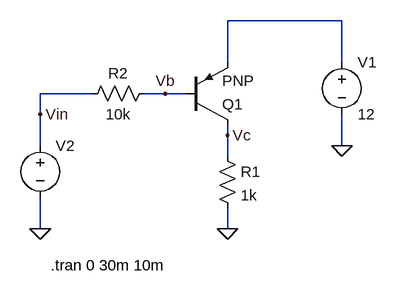
[diagram p0: schematic lab4_2_positive.asc]
lab4_2_positive.asc, the LTspice schematic file:
Version 4
SHEET 1 880 680
WIRE 544 -32 368 -32
WIRE 368 32 368 -32
WIRE 544 32 544 -32
WIRE 160 80 80 80
WIRE 272 80 240 80
WIRE 304 80 272 80
WIRE 80 112 80 80
WIRE 368 144 368 128
WIRE 80 160 80 112
WIRE 544 160 544 112
WIRE 368 176 368 144
WIRE 80 288 80 240
WIRE 368 288 368 256
FLAG 272 80 Vb
FLAG 368 144 Vc
FLAG 80 112 Vin
FLAG 368 288 0
FLAG 544 160 0
FLAG 80 288 0
SYMBOL voltage 80 144 R0
WINDOW 3 24 96 Invisible 2
WINDOW 123 0 0 Left 0
WINDOW 39 0 0 Left 0
SYMATTR Value PULSE(0 12 10e-3 10e-3 10e-3 10e-3 30e-3 1)
SYMATTR InstName V2
SYMBOL res 144 96 R270
WINDOW 0 32 56 VTop 2
WINDOW 3 0 56 VBottom 2
SYMATTR InstName R2
SYMATTR Value 10k
SYMBOL res 352 160 R0
SYMATTR InstName R1
SYMATTR Value 1k
SYMBOL voltage 544 16 R0
WINDOW 123 0 0 Left 0
WINDOW 39 0 0 Left 0
SYMATTR InstName V1
SYMATTR Value 12
SYMBOL pnp 304 128 M180
SYMATTR InstName Q1
TEXT 96 344 Left 2 !.tran 0 30m 10m

The netlist it stands for:
* lab4_2_positive.asc
V2 Vin 0 PULSE(0 12 10e-3 10e-3 10e-3 10e-3 30e-3 1)
R2 Vin Vb 10k
R1 Vc 0 1k
V1 N001 0 12
Q1 Vc Vb N001 0 PNP
.model NPN NPN
.model PNP PNP
.lib standard.bjt
.tran 0 30m 10m
.backanno
.end